# Altium schematic sheet 000_BBB_Pinouts.SchDoc: Oasis Pinouts
size A; Revision: 1; SheetNumber: 1
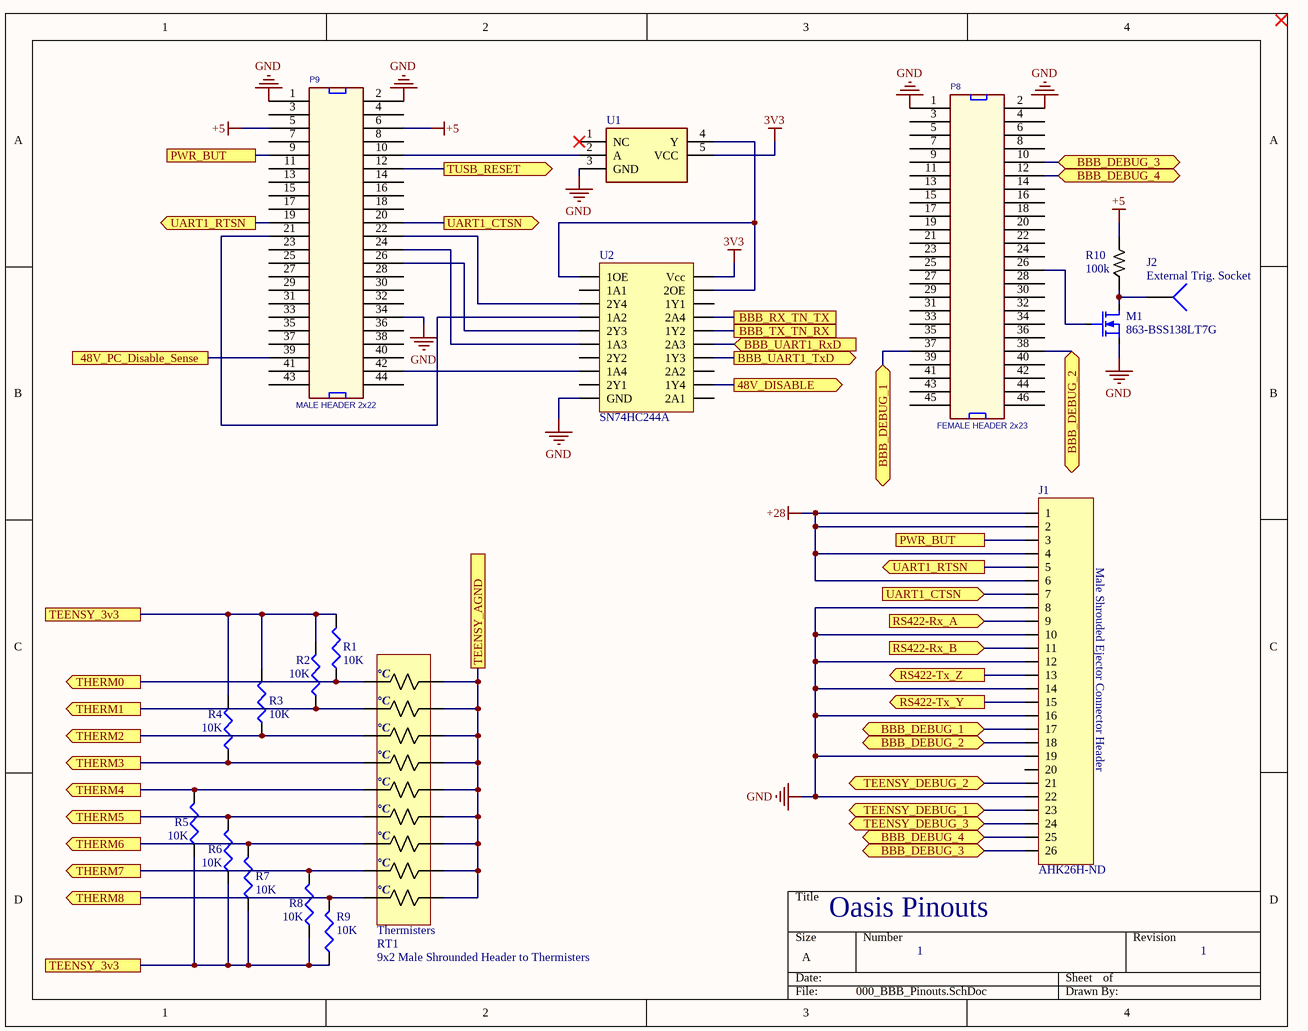
[diagram p0: 000_BBB_Pinouts.SchDoc]

## Parts
J1  Supplier Part Number 1: AHK26H-ND  [TE_5499922-6]  (hidden comment: TE_5499922-6)
J2  External Trig. Socket  [PIN1]
M1  Supplier Part Number 1: 863-BSS138LT7G  [SOT95P245X110-3N]  (hidden comment: BSS138LT7G)
P8  FEMALE HEADER 2x23  [MAJOR-TSHC-123-D-03_V_FLIPPED]
P9  MALE HEADER 2x22  [MAJOR-TSHC-123-D-03_V_TRIMMED]
R1  value 10K  [Imperial0603_RES]  (hidden comment: 10K Resistor)
R2  value 10K  [Imperial0603_RES]  (hidden comment: 10K Resistor)
R3  value 10K  [Imperial0603_RES]  (hidden comment: 10K Resistor)
R4  value 10K  [Imperial0603_RES]  (hidden comment: 10K Resistor)
R5  value 10K  [Imperial0603_RES]  (hidden comment: 10K Resistor)
R6  value 10K  [Imperial0603_RES]  (hidden comment: 10K Resistor)
R7  value 10K  [Imperial0603_RES]  (hidden comment: 10K Resistor)
R8  value 10K  [Imperial0603_RES]  (hidden comment: 10K Resistor)
R9  value 10K  [Imperial0603_RES]  (hidden comment: 10K Resistor)
R10  value 100k  [Imperial0603_RES]  (hidden comment: MCT06030E1003BP500)
RT1  NTC Thermister Array  [MOLEX 90130-1118]  (value not drawn)
U1  single gate inverter  [SOT65P210X110-5N]  (value not drawn)
U2  Tristate buffer  [SOP65P780X200-20N]  (value not drawn)

## Ports
48V_DISABLE (out), 48V_PC_Disable_Sense, BBB_DEBUG_1 (bidir), BBB_DEBUG_2 (bidir), BBB_DEBUG_3 (bidir), BBB_DEBUG_4 (bidir), BBB_RX_TN_TX, BBB_TX_TN_RX, BBB_UART1_RxD (in), BBB_UART1_TxD (out), PWR_BUT, RS422-Rx_A (in), RS422-Rx_B (in), RS422-Tx_Y (out), RS422-Tx_Z (out), TEENSY_3v3, TEENSY_AGND, TEENSY_DEBUG_1 (bidir), TEENSY_DEBUG_2 (bidir), TEENSY_DEBUG_3 (bidir), THERM0 (out), THERM1 (out), THERM2 (out), THERM3 (out), THERM4 (out), THERM5 (out), THERM6 (out), THERM7 (out), THERM8 (out), TUSB_RESET (out), UART1_CTSN (in), UART1_CTSN (out), UART1_RTSN (out)

## Nets
3V3: U1.5(VCC) U2.20(Vcc)
+5: P9.5 P9.6 R10.1
+28: J1.1 J1.2 J1.4 J1.6
GND: J1.8 J1.10 J1.12 J1.14 J1.16 J1.19 J1.22 M1.2(S) P8.1 P8.2 P9.1 P9.2 P9.34 U1.3(GND) U2.10(GND)
48V_DISABLE: U2.12(1Y4) ; port 48V_DISABLE
48V_PC_Disable_Sense: P9.39 ; port 48V_PC_Disable_Sense
BBB_DEBUG_1: J1.17 P8.37 ; port BBB_DEBUG_1
BBB_DEBUG_2: J1.18 P8.38 ; port BBB_DEBUG_2
BBB_DEBUG_3: J1.26 P8.10 ; port BBB_DEBUG_3
BBB_DEBUG_4: J1.25 P8.12 ; port BBB_DEBUG_4
BBB_RX_TN_TX: U2.17(2A4) ; port BBB_RX_TN_TX
BBB_TX_TN_RX: U2.16(1Y2) ; port BBB_TX_TN_RX
BBB_UART1_RxD: U2.15(2A3) ; port BBB_UART1_RxD
BBB_UART1_TxD: U2.14(1Y3) ; port BBB_UART1_TxD
PWR_BUT: J1.3 P9.9 ; port PWR_BUT
RS422-Rx_A: J1.9 ; port RS422-Rx_A
RS422-Rx_B: J1.11 ; port RS422-Rx_B
RS422-Tx_Y: J1.15 ; port RS422-Tx_Y
RS422-Tx_Z: J1.13 ; port RS422-Tx_Z
TEENSY_3v3: R1.2 R2.2 R3.2 R4.2 R5.1 R6.2 R7.2 R8.2 R9.2 ; port TEENSY_3v3
TEENSY_AGND: RT1.2 RT1.4 RT1.6 RT1.8 RT1.10 RT1.12 RT1.14 RT1.16 RT1.18 ; port TEENSY_AGND
TEENSY_DEBUG_1: J1.23 ; port TEENSY_DEBUG_1
TEENSY_DEBUG_2: J1.21 ; port TEENSY_DEBUG_2
TEENSY_DEBUG_3: J1.24 ; port TEENSY_DEBUG_3
THERM0: R1.1 RT1.1 ; port THERM0
THERM1: R2.1 RT1.3 ; port THERM1
THERM2: R3.1 RT1.5 ; port THERM2
THERM3: R4.1 RT1.7 ; port THERM3
THERM4: R5.2 RT1.9 ; port THERM4
THERM5: R6.1 RT1.11 ; port THERM5
THERM6: R7.1 RT1.13 ; port THERM6
THERM7: R8.1 RT1.15 ; port THERM7
THERM8: R9.1 RT1.17 ; port THERM8
TUSB_RESET: P9.12 ; port TUSB_RESET
UART1_CTSN: J1.7 P9.20 ; port UART1_CTSN
UART1_RTSN: J1.5 P9.19 ; port UART1_RTSN
NetJ2_1: J2.1 M1.3(D) R10.2
NetM1_1: M1.1(G) P8.26
NetP9_10: P9.10 U1.2(A)
NetP9_21: P9.21 U2.4(1A2)
NetP9_22: P9.22 U2.3(2Y4)
NetP9_24: P9.24 U2.6(1A3)
NetP9_26: P9.26 U2.5(2Y3)
NetP9_42: P9.42 U2.8(1A4)
NetU1_4: U1.4(Y) U2.1(1OE) U2.19(2OE)

Not connected (* = marked no-connect by the designer): J1 20; P8 3(2) 4(27) 5(3) 6(28) 7(4) 8(29) 9(5) 11(6) 13(7) 14(32) 15(8) 16(33) 17(9) 18(34) 19(10) 20(35) 21(11) 22(36) 23(12) 24(37) 25(13) 27(14) 28(39) 29(15) 30(40) 31(16) 32(41) 33(17) 34(42) 35(18) 36(43) 39(20) 40(45) 41(21) 42(46) 43(22) 44(47) 45(23) 46(48); P9 3(2) 4(27) 7(4) 8(29) 11(6) 13(7) 14(32) 15(8) 16(33) 17(9) 18(34) 23(12) 25(13) 27(14) 28(39) 29(15) 30(40) 31(16) 32(41) 33(17) 35(18) 36(43) 37(19) 38(44) 40(45) 41(21) 43(22) 44(47); U1 1(NC)*; U2 2(1A1) 7(2Y2) 9(2Y1) 11(2A1) 13(2A2) 18(1Y1)

## Notes on the sheet
- Male Shrouded Ejector Connector Header
- 9x2 Male Shrounded Header to Thermisters
- (in symbol Thermisters) °C

## Library data of the parts
J1 = TE_5499922-6: AMP-LATCH Universal Headers - 26 Pos; Supplier 1: Digi-Key
J2 = Socket: LatestRevisionDate: 17-Jul-2002; LatestRevisionNote: Re-released for DXP Platform.; Publisher: Altium Limited
M1 = BSS138LT7G: N-MOSFET for logic level switching; Supplier 1: Mouser
P8 = HDR_46_F_2_0.1_0.1: 2x23 Female Pin header, 2.54mm, gold plated; Manufacturer: Sullins Connector Solutions; Manufacturer Part Number: PPPC232LFBN-RC; Number of Positions: 46; Number of Positions Loaded: All; Pitch: 0.100" (2.54mm); Supplier 1: Digi-Key; Supplier Part Number 1: SAM1196-23-ND; RoHS: RoHS Compliant; Category: Connectors, Interconnects; Stock 1: 750; Pricing 1: 1=2.75, 10=2.325, 25=2.2196, 50=2.0084, 100=1.7969, 250=1.58552, 500=1.4798, 1000=1.3741, 2500=1.32125 (USD); Connector Type: Header; Contact Type: Female Socket; Number of Rows: 2; Row Spacing: 0.100" (2.54mm); Mounting Type: Through Hole; Termination: Solder; Fastening Type: -; Features: -; Contact Finish: Gold; Contact Finish Thickness: Flash; Color: Black; Packaging: Bulk; ComponentLink1URL: http://www.sullinscorp.com/drawings/78_P(N)PxCxxxLFBN-RC,_10492-G.pdf; ComponentLink1Description: http://www.sullinscorp.com/drawings/78_P(N)PxCxxxLFBN-RC,_10492-G.pdf
P9 = HDR_44_M_TRIMMED: 2x22 Male Pin header, 2.54mm, gold plated; Manufacturer: Sullins Connector Solutions; Manufacturer Part Number: PPPC232LFBN-RC; Number of Positions: 46; Number of Positions Loaded: All; Pitch: 0.100" (2.54mm); Supplier 1: Digi-Key; Supplier Part Number 1: SAM1196-23-ND; RoHS: RoHS Compliant; Category: Connectors, Interconnects; Stock 1: 750; Pricing 1: 1=2.75, 10=2.325, 25=2.2196, 50=2.0084, 100=1.7969, 250=1.58552, 500=1.4798, 1000=1.3741, 2500=1.32125 (USD); Connector Type: Header; Contact Type: Female Socket; Number of Rows: 2; Row Spacing: 0.100" (2.54mm); Mounting Type: Through Hole; Termination: Solder; Fastening Type: -; Features: -; Contact Finish: Gold; Contact Finish Thickness: Flash; Color: Black; Packaging: Bulk; ComponentLink1URL: http://www.sullinscorp.com/drawings/78_P(N)PxCxxxLFBN-RC,_10492-G.pdf; ComponentLink1Description: http://www.sullinscorp.com/drawings/78_P(N)PxCxxxLFBN-RC,_10492-G.pdf
R1-R9 = RN731JTTD1002F10: 10K resistor, Thermister Pullup Resistor; Published: 8-Jun-2000; LatestRevisionDate: 29-May-2009; LatestRevisionNote: IPC-7351 Footprint Added.; PackageReference: J1-0603; Publisher: Altium Limited; PackageDescription: Chip Resistor; Supplier 1: Mouser; Supplier Part Number 1: 660-RN731JTTD1002F10
R10 = MCT06030E1003BP500: 100 kOhm Resistor; Supplier 1: Mouser; Supplier Part Number 1: 594-MCT06030E1003BP5
RT1 = Thermisters: NTC Thermisters to monitor temperature of box. On PCB this will be a pin header.
U1 = SN74AHC1G14DCK3: Inverter, single gate; Manufacturer_Name: Texas Instruments; Datasheet Link: https://www.arrow.com/en/products/sn74ahc1g14dck3/texas-instruments; Height: 1.1mm; Manufacturer_Part_Number: SN74AHC1G14DCK3
U2 = SN74HC244A: Tristate buffer for protecting the BBB during power down.; Supplier 1: Mouser; Supplier Part Number 1: 595-SN74HC244APWR; IC Family: SN74HC244A